# EAGLE design Gimbal Driveboard (EAGLE 8.4.3)
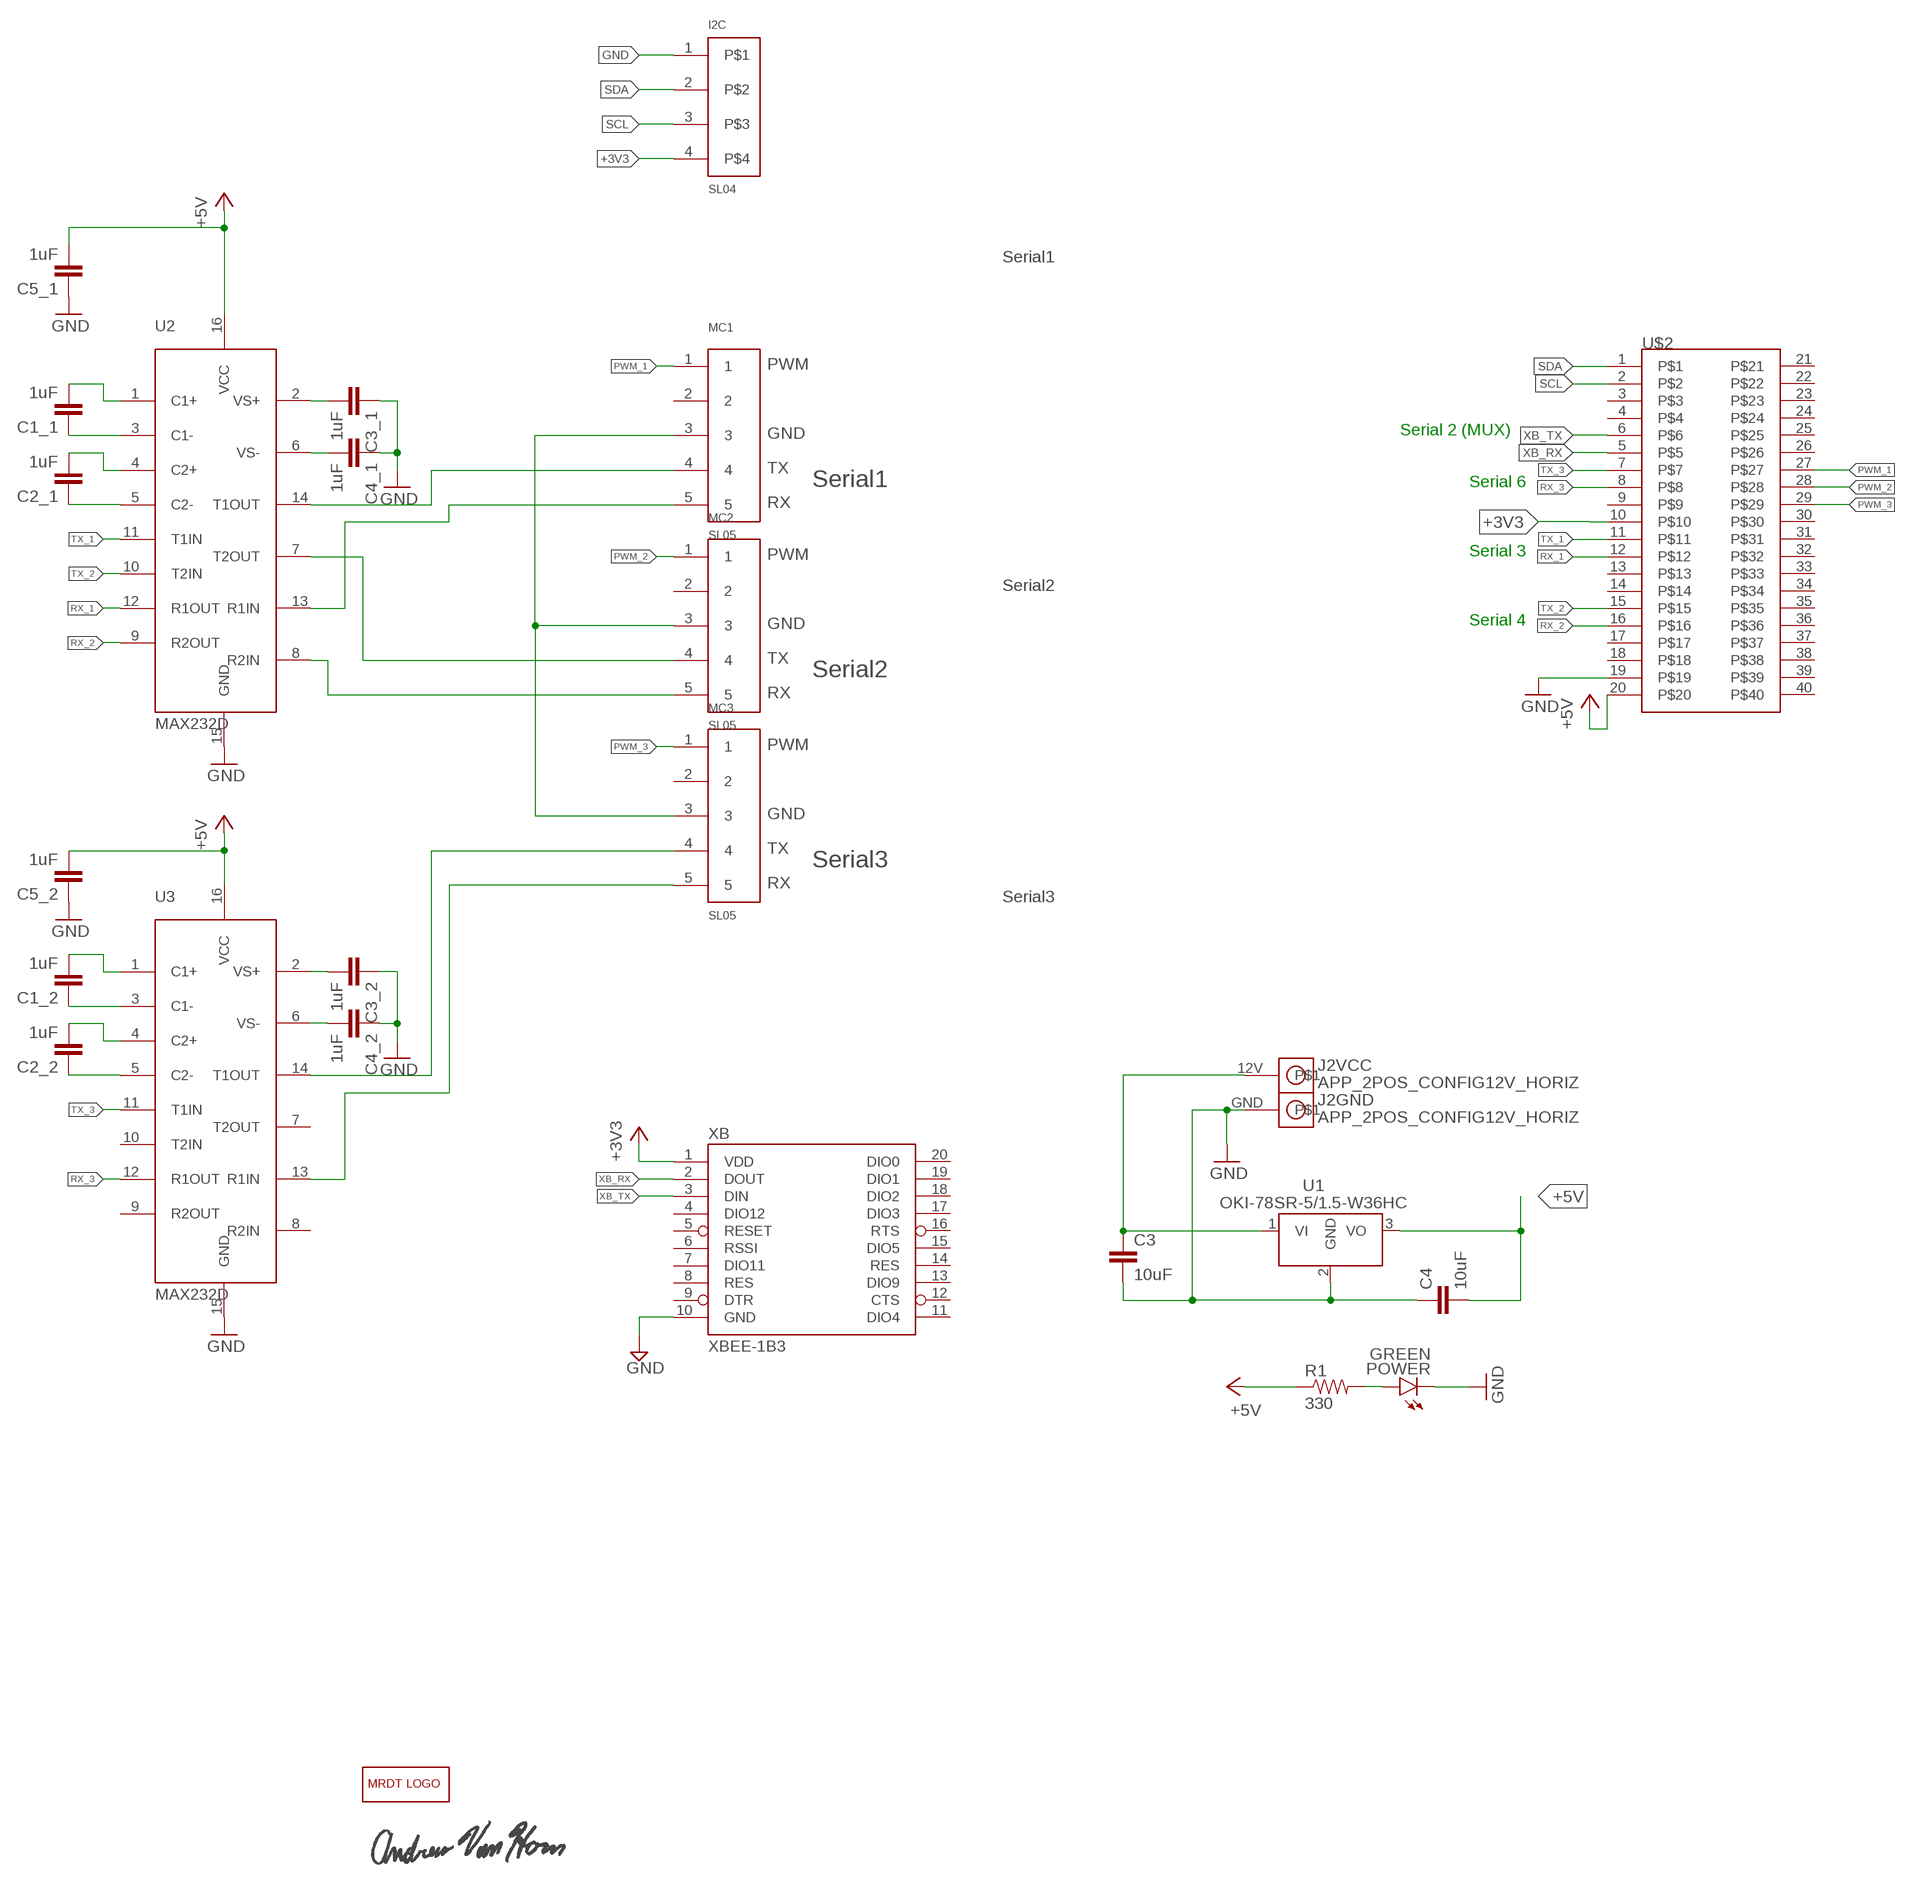
[diagram p0: schematic, sheet 1]

## Parts
C1_1  1uF  CAP0805  [0805]
C1_2  1uF  CAP0805  [0805]
C2_1  1uF  CAP0805  [0805]
C2_2  1uF  CAP0805  [0805]
C3  10uF  CAP0805  [0805]
C3_1  1uF  CAP0805  [0805]
C3_2  1uF  CAP0805  [0805]
C4  10uF  CAP0805  [0805]
C4_1  1uF  CAP0805  [0805]
C4_2  1uF  CAP0805  [0805]
C5_1  1uF  CAP0805  [0805]
C5_2  1uF  CAP0805  [0805]
I2C  SL04  [MOLEX_SL_04_TH]
J2  APP_2POS_CONFIG12V_HORIZ  [APP45_12V_HORIZ_CONFIG]
LOGO1  MRDT_LOGO  [MRDT_LOGO]
MC1  SL05  [MOLEX_SL_05_TH]
MC2  SL05  [MOLEX_SL_05_TH]
MC3  SL05  [MOLEX_SL_05_TH]
POWER  GREEN  LED-GREEN1206  [LED-1206]
R1  330  0.22OHM-1/4W-1%(0805)  [0805]
U1  OKI-78SR-5/1.5-W36HC  [OKI-78SR_HORIZ]
U2  MAX232D  [SOIC16]
U3  MAX232D  [SOIC16]
U$2  TI_BACKPACK_HEADER  [TI_BACKPACK_HEADER]
U$3  ANDREW_VAN_HORN_SIGNATURE  [ANDREW_VAN_HORN_SIGNATURE]
XB  XBEE-1B3  [XBEE-SMD]

## Nets
+3V3: I2C.4 U$2.10 XB.1(VDD)
+5V: C4.2 C5_1.2 C5_2.2 R1.1 U1.3(VO) U2.16(VCC) U3.16(VCC) U$2.20
GND: C3.2 C3_1.1 C3_2.1 C4.1 C4_1.1 C4_2.1 C5_1.1 C5_2.1 I2C.1 J2.GND MC1.3 MC2.3 MC3.3 POWER.C U1.2(GND) U2.15(GND) U3.15(GND) U$2.19 XB.10(GND)
N$3: C1_1.2 U2.1(C1+)
N$4: C1_1.1 U2.3(C1-)
N$5: C3.1 J2.12V U1.1(VI)
N$6: C2_1.2 U2.4(C2+)
N$7: C2_1.1 U2.5(C2-)
N$8: C3_1.2 U2.2(VS+)
N$9: C4_1.2 U2.6(VS-)
N$11: C1_2.2 U3.1(C1+)
N$12: C1_2.1 U3.3(C1-)
N$13: C2_2.2 U3.4(C2+)
N$14: C3_2.2 U3.2(VS+)
N$15: C4_2.2 U3.6(VS-)
N$16: C2_2.1 U3.5(C2-)
N$17: POWER.A R1.2
N$32: MC3.4 U3.14(T1OUT)
N$33: MC3.5 U3.13(R1IN)
N$34: MC2.5 U2.8(R2IN)
N$35: MC2.4 U2.7(T2OUT)
N$36: MC1.4 U2.14(T1OUT)
N$37: MC1.5 U2.13(R1IN)
PWM_1: MC1.1 U$2.27
PWM_2: MC2.1 U$2.28
PWM_3: MC3.1 U$2.29
RX_1: U2.12(R1OUT) U$2.12
RX_2: U2.9(R2OUT) U$2.16
RX_3: U3.12(R1OUT) U$2.8
SCL: I2C.3 U$2.2
SDA: I2C.2 U$2.1
TX_1: U2.11(T1IN) U$2.11
TX_2: U2.10(T2IN) U$2.15
TX_3: U3.11(T1IN) U$2.7
XB_RX: U$2.5 XB.2(DOUT)
XB_TX: U$2.6 XB.3(DIN)
Unconnected: MC1.2 MC2.2 MC3.2 U3.7(T2OUT) U3.8(R2IN) U3.9(R2OUT) U3.10(T2IN) U$2.3 U$2.4 U$2.9 U$2.13 U$2.14 U$2.17 U$2.18 U$2.21 U$2.22 U$2.23 U$2.24 U$2.25 U$2.26 U$2.30 U$2.31 U$2.32 U$2.33 U$2.34 U$2.35 U$2.36 U$2.37 U$2.38 U$2.39 U$2.40 XB.4(DIO12) XB.5(RESET) XB.6(RSSI) XB.7(DIO11) XB.8(RES) XB.9(DTR) XB.11(DIO4) XB.12(CTS) XB.13(DIO9) XB.14(RES) XB.15(DIO5) XB.16(RTS) XB.17(DIO3) XB.18(DIO2) XB.19(DIO1) XB.20(DIO0)

## Notes on the sheet
- Serial1
- PWM
- GND | Serial 2 (MUX)
- TX
- Serial1 | Serial 6
- RX
- PWM | Serial 3
- Serial2
- GND | Serial 4
- TX
- Serial2
- RX
- PWM
- GND
- TX
- Serial3
- RX
- Serial3

## Library data of the parts
C1_1 C1_2 C2_1 C2_2 C3 C3_1 C3_2 C4 C4_1 C4_2 C5_1 C5_2 = SparkFun-Capacitors:CAP: Capacitor Standard 0603 ceramic capacitor, and 0.1" leaded capacitor.
I2C = MRDT-Connectors:SL04
J2 = MRDT-Connectors:APP_2POS_CONFIG; COLOR1: YELLOW; COLOR2: BLACK
LOGO1 = MRDT-Hardware:MRDT_LOGO
MC1-MC3 = MRDT-Connectors:SL05
POWER = SparkFun-LED:LED-GREEN: Various green LEDs Green LEDs used in SFE Production 0603- DIO-00821 LARGE- DIO-00862 LILYPAD- DIO-09910; PROD_ID: DIO-00862
R1 = SparkFun-Resistors:0.22OHM-1/4W-1%(0805): RES-09883; PROD_ID: RES-09883; VALUE: 0.22
U1 = MRDT-ICs:OKI-78SR-*/1.5-W36?C: 4.95W DC/DC Converter Manufacturer: Murata; VOUT: +5v
U2 U3 = MRDT-ICs:MAX*232; OPERATING_VOLTAGE: 5V
U$2 = TI_HEADERS:TI_BACKPACK_HEADER: TI's standard for backpack header spacing with 80 pins
U$3 = MRDT-Signatures:ANDREW_VAN_HORN_SIGNATURE
XB = SparkFun:XBEE-1

## Net classes
0 default: width 0.254 mm, clearance 0.254 mm

## Board
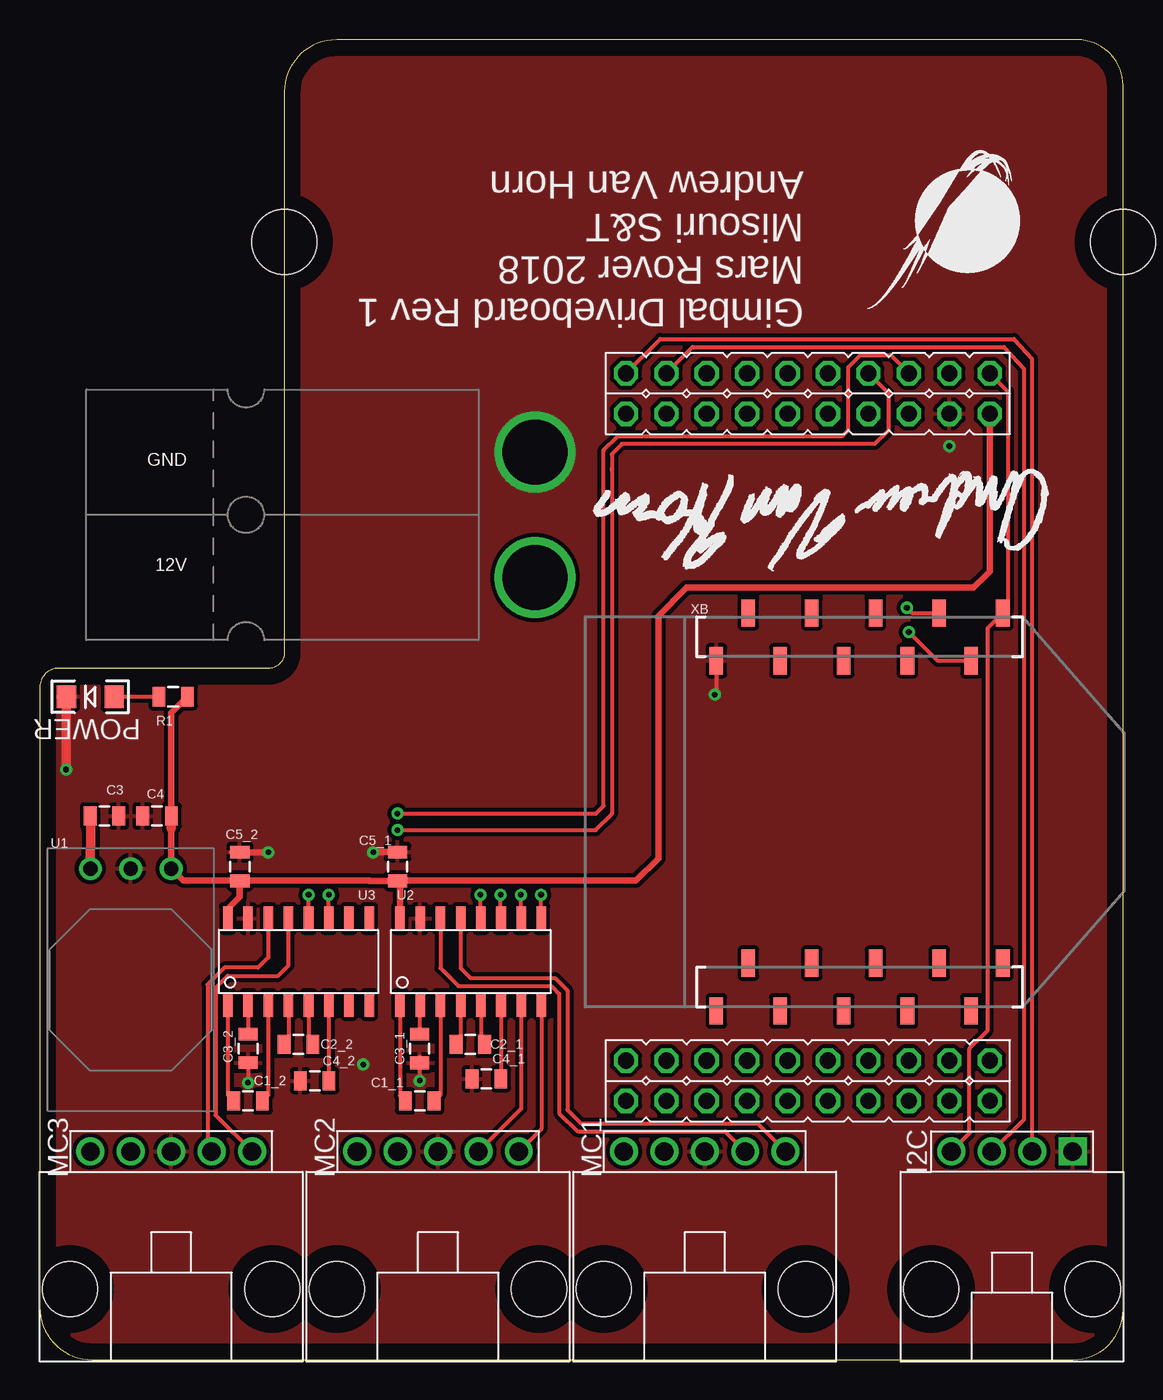
[diagram p1: board, top side]
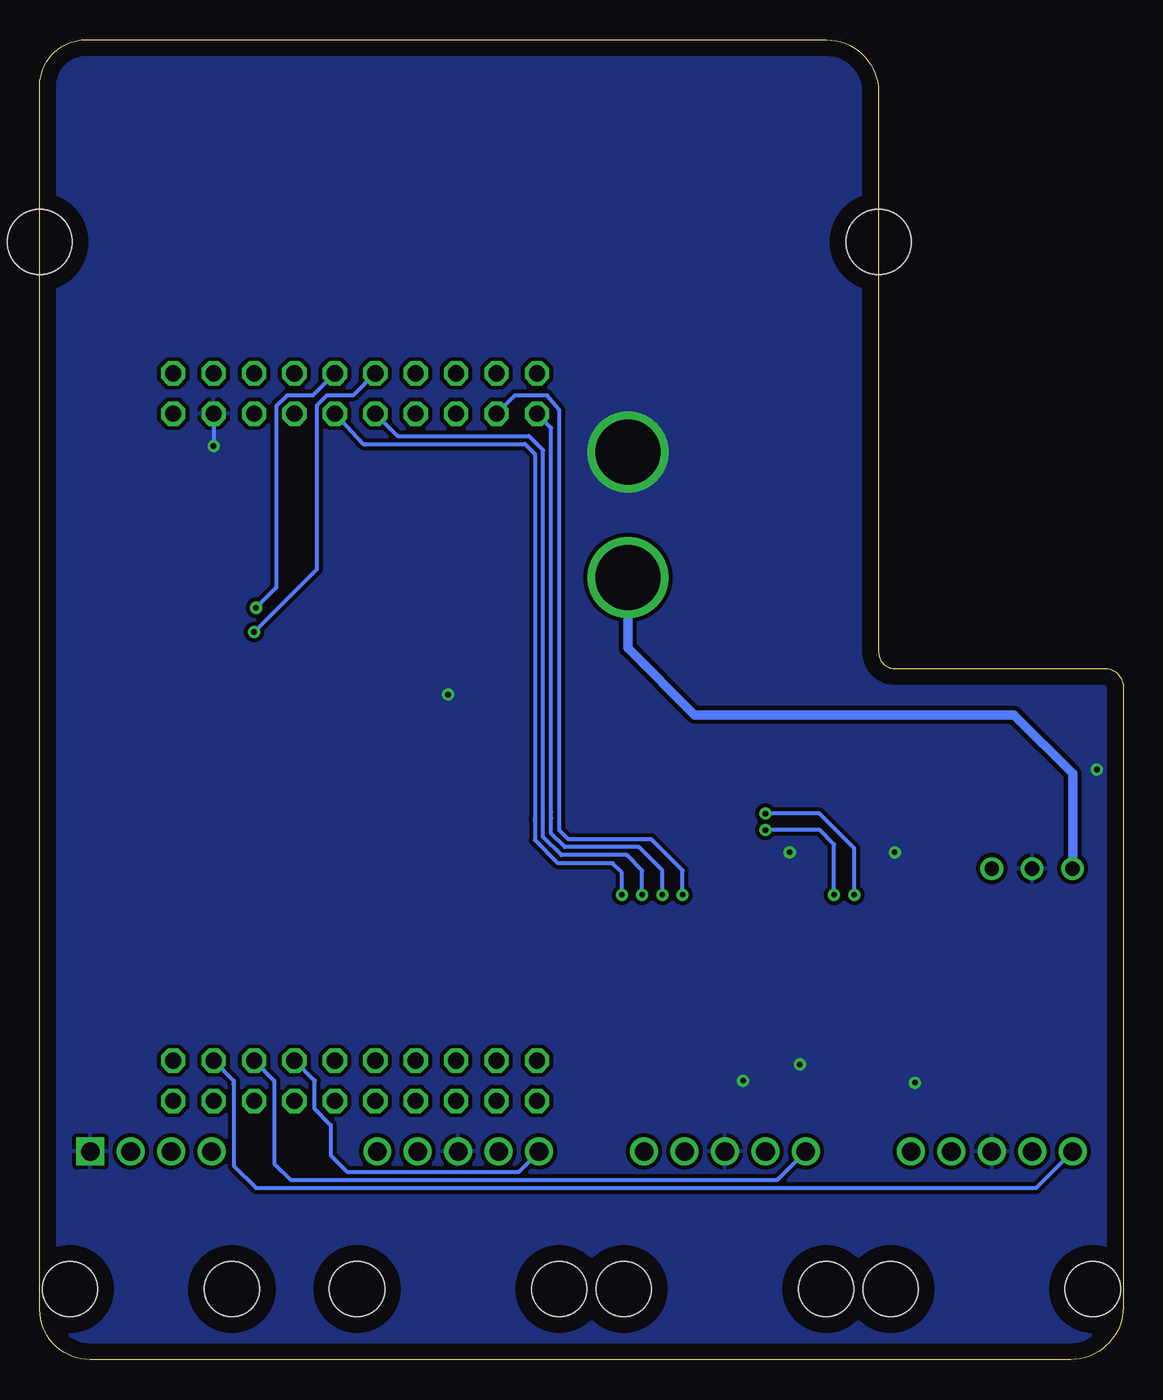
[diagram p2: board, bottom side, seen from below]

Size 68.07 x 82.93 mm. Coordinates in mm from the lower left corner, seen from the top.
Outline: 15.37,79.65 15.37,44.43 arc-90 14.37,43.43 1.16,43.43 arc90 0,42.27 0,3.3 arc90 3.3,0 64.92,0 arc90 68.07,3.15 68.07,80.05 arc90 65.2,82.93 18.64,82.93 arc90 15.37,79.65
Copper layers (1*16): Top 0.035mm / dielectric 1.5mm / Bottom 0.035mm
Design rules "default": minimum track width 6mil, minimum drill 0.35mm, track to track 6mil, track to pad 6mil, pad to pad 6mil, via to via 6mil, smd to smd 6mil, copper to edge 40mil, drill to drill 6mil, minimum pad ring 10mil, minimum via ring 8mil, stop-mask expansion 4mil, vias tented up to drill 0mil, thermal gap 10mil
Holes 4.06 mm at 15.37,70.23 68.07,70.23

### Footprints (pad centres in the part's own frame; a part is rotated, then mirrored left to right if it is on the bottom)
0805 = smd 0.8 x 1.2: 1 -0.9,0; 2 0.9,0
MOLEX_SL_04_TH = drill 1.168 square: 1 -3.81,0 | drill 1.168: 2 -1.27,0; 3 1.27,0; 4 3.81,0 | hole 3.454: -5.08,8.636; 5.08,8.636
APP45_12V_HORIZ_CONFIG = drill 4.064: 12V 28.194,3.937; GND 28.194,11.811
MOLEX_SL_05_TH = drill 1.168: 1 5.08,0; 2 2.54,0; 3 0,0; 4 -2.54,0; 5 -5.08,0 | hole 3.454: -6.35,8.636; 6.35,8.636
LED-1206 = smd 1.2 x 1.4: A -1.5,0; C 1.5,0
OKI-78SR_HORIZ = drill 0.9 pad 1.422: 1 0,0; 2 -2.54,0; 3 -5.08,0
SOIC16 = smd 0.6 x 1.55: 1 -4.445,-2.7; 2 -3.175,-2.7; 3 -1.905,-2.7; 4 -0.635,-2.7; 5 0.635,-2.7; 6 1.905,-2.7; 7 3.175,-2.7; 8 4.445,-2.7; 9 4.445,2.7; 10 3.175,2.7; 11 1.905,2.7; 12 0.635,2.7; 13 -0.635,2.7; 14 -1.905,2.7; 15 -3.175,2.7; 16 -4.445,2.7
TI_BACKPACK_HEADER = drill 1.016 octagon: 1 1.27,46.99; 2 3.81,46.99; 3 6.35,46.99; 4 8.89,46.99; 5 11.43,46.99; 6 13.97,46.99; 7 16.51,46.99; 8 19.05,46.99; 9 21.59,46.99; 10 24.13,46.99; 11 1.27,44.45; 12 3.81,44.45; 13 6.35,44.45; 14 8.89,44.45; 15 11.43,44.45; 16 13.97,44.45; 17 16.51,44.45; 18 19.05,44.45; 19 21.59,44.45; 20 24.13,44.45; 21 1.27,3.81; 22 3.81,3.81; 23 6.35,3.81; 24 8.89,3.81; 25 11.43,3.81; 26 13.97,3.81; 27 16.51,3.81; 28 19.05,3.81; 29 21.59,3.81; 30 24.13,3.81; 31 1.27,1.27; 32 3.81,1.27; 33 6.35,1.27; 34 8.89,1.27; 35 11.43,1.27; 36 13.97,1.27; 37 16.51,1.27; 38 19.05,1.27; 39 21.59,1.27; 40 24.13,1.27
XBEE-SMD = smd 1.7 x 0.85: 1 -12.5,20; 2 -9.5,18; 3 -12.5,16; 4 -9.5,14; 5 -12.5,12; 6 -9.5,10; 7 -12.5,8; 8 -9.5,6; 9 -12.5,4; 10 -9.5,2; 11 12.5,2; 12 9.5,4; 13 12.5,6; 14 9.5,8; 15 12.5,10; 16 9.5,12; 17 12.5,14; 18 9.5,16; 19 12.5,18; 20 9.5,20

### Placement (x,y rotation side)
C1_1  23.88,16.26 180 top
C1_2  13.08,16.26 180 top
C2_1  27.05,19.81 180 top
C2_2  16.26,19.81 180 top
C3  4.06,34.16 0 top
C3_1  23.87,19.56 90 top
C3_2  13.08,19.56 90 top
C4  7.37,34.16 0 top
C4_1  28.07,17.65 0 top
C4_2  17.27,17.53 0 top
C5_1  22.48,30.99 270 top
C5_2  12.57,30.99 270 top
I2C  61.09,13.08 180 top
J2  2.92,45.21 0 top
LOGO1  61.59,76.83 180 top
MC1  41.78,13.08 180 top
MC2  25.02,13.08 180 top
MC3  8.25,13.08 180 top
POWER  3.17,41.66 180 top
R1  8.38,41.66 180 top
U1  3.17,30.86 180 top
U2  27.08,25.02 0 top
U3  16.26,25.02 0 top
U$2  35.56,14.99 0 top
U$3  64.64,56.9 180 top
XB  40.51,34.42 270 top

### Tracks (layer width: path | path; a pad name or v marks a point on that pad's centre or on a via)
+3V3
  Top 0.254: I2C.4 58.42,14.22 58.42,19.56 59.56,20.7 59.56,45.97 XB.1 60.83,47.24 60.83,60.83 U$2.10
+5V
  Top 0.254: 22.61,27.75 U2.16 | 12.07,30.1 C5_2.2 | 22.63,30.07 22.62,30.09 C5_1.2 22.72,30.09
  Top 0.406: 22.61,28.19 22.61,27.75 | 8.25,33.39 U1.3 9.02,30.1 12.07,30.1 20.7,30.1 20.7,30.09 C5_1.2 22.61,30.1 | 22.73,27.82 U2.16 22.63,30.07 22.61,30.1 | 59.44,49.28 59.69,49.53 | 59.44,49.28 58.67,48.51 40.64,48.51 38.86,46.74 38.86,31.5 37.46,30.1 22.61,30.1 | 22.72,30.09 22.73,30.1 | C4.2 8.27,40.64 R1.1 | C5_2.2 12.57,29.08 11.81,28.32 U3.16 | 59.69,49.53 59.44,49.28 | U$2.20 59.69,49.53
  Top 0.61: 8.25,33.39 C4.2 8.27,33.42
GND  (via drill 0.35)
  Top 0.254: 23.88,19.04 C3_1.1 23.87,18.04 v23.88,17.53 | C3_2.1 v13.08,17.4 | XB.10 42.51,41.88 v42.42,41.78
  Top 0.406: C5_1.1 20.97,31.89 v20.96,31.88 | C5_2.1 12.08,31.88 v14.35,31.88
  Top 0.61: POWER.C 1.67,40.23 v1.65,37.08
  Bottom 0.254: U$2.19 v57.15,57.4
  other vias: 20.32,18.54
  pour Top: 0,64.13 2.67,83.69 67.44,83.31 68.2,0.13 -0.76,0
  pour Bottom: -0.38,83.44 67.69,83.69 68.2,0.13 -0.76,0.13
N$3
  Top 0.254: U2.1 22.63,16.6 C1_1.2
N$4
  Top 0.254: U2.3 25.17,16.65 C1_1.1
N$5
  Top 0.61: C3.1 3.19,33.28 U1.1
  Bottom 0.61: U1.1 3.17,36.83 6.86,40.51 26.92,40.51 31.12,44.7 J2.12V
N$6
  Top 0.254: U2.4 26.44,20.1 C2_1.2
N$7
  Top 0.254: U2.5 27.71,20.05 C2_1.1
N$8
  Top 0.254: U2.2 23.87,22.29 C3_1.2
N$9
  Top 0.254: U2.6 28.97,22.3 C4_1.2
N$11
  Top 0.254: U3.1 11.81,16.63 C1_2.2
N$12
  Top 0.254: U3.3 14.35,16.63 C1_2.1
N$13
  Top 0.254: U3.4 15.62,20.08 C2_2.2
N$14
  Top 0.254: U3.2 C3_2.2
N$15
  Top 0.254: U3.6 C4_2.2
N$16
  Top 0.254: U3.5 16.89,20.08 C2_2.1
N$17
  Top 0.254: POWER.A R1.2
N$32
  Top 0.254: U3.14 14.35,25.27 13.72,24.64 11.6,24.64 10.54,23.58 10.54,13.34 MC3.4
N$33
  Top 0.254: U3.13 15.62,24.77 14.99,24.13 11.81,24.13 11.05,23.37 11.05,15.37 MC3.5
N$34
  Top 0.254: U2.8 31.52,14.5 MC2.5
N$35
  Top 0.254: U2.7 30.25,15.77 MC2.4
N$36
  Top 0.254: U2.14 25.17,24.61 26.31,23.48 32.15,23.48 32.64,22.99 32.64,15.49 33.78,14.35 43.05,14.35 MC1.4
N$37
  Top 0.254: U2.13 26.44,24.61 27.07,23.98 32.36,23.98 33.15,23.2 33.15,15.7 33.99,14.86 45.09,14.86 MC1.5
PWM_1
  Bottom 0.254: MC1.1 37.97,11.81 48.77,11.81 49.78,12.83 49.78,14.73 50.8,15.75 50.8,17.53 U$2.27
PWM_2
  Bottom 0.254: MC2.1 21.72,11.3 52.32,11.3 53.34,12.32 53.34,17.53 U$2.28
PWM_3
  Bottom 0.254: 55.88,17.27 55.88,17.4 | 55.88,17.27 55.88,12.19 54.48,10.79 5.46,10.79 MC3.1 | U$2.29 55.88,17.53 55.88,17.27
RX_1  (via drill 0.35)
  Top 0.254: U2.12 27.69,27.75 v27.69,29.21
  Bottom 0.254: v27.69,29.21 27.69,30.73 29.67,32.71 34.87,32.71 35.43,33.27 35.43,59.69 36.2,60.58 38.23,60.58 U$2.12
RX_2  (via drill 0.35)
  Top 0.254: 31.37,28.32 31.37,27.87 U2.9 31.5,27.75 v31.5,29.21
  Bottom 0.254: v31.5,29.21 31.5,30.61 32.08,31.19 35.5,31.19 36.96,32.64 36.96,33.91 | 36.96,33.91 36.96,34.04 | 36.96,33.91 36.96,56.9 37.59,57.53 47.75,57.53 U$2.16
RX_3  (via drill 0.35)
  Top 0.254: U3.12 v16.89,29.21 | v22.48,34.31 34.95,34.31 35.43,34.8 35.43,57.15 36.32,58.04 50.42,58.04 50.8,58.42 50.8,62.36 51.56,63.12 53.47,63.12 U$2.8
  Bottom 0.254: v16.89,29.21 16.89,32.13 19.07,34.31 v22.48,34.31
SCL
  Top 0.254: I2C.3 61.85,15.11 61.85,62.23 60.58,63.63 41.02,63.63 U$2.2
SDA
  Top 0.254: I2C.2 62.36,62.87 61.21,64.13 38.99,64.13 U$2.1
TX_1  (via drill 0.35)
  Top 0.254: U2.11 28.96,27.75 v28.96,29.21
  Bottom 0.254: v28.96,29.21 28.96,30.73 30.43,32.21 35.09,32.21 35.94,33.06 35.94,34.04 | 35.94,34.04 35.94,34.42 | U$2.11 35.94,58.55 35.94,34.04
TX_2  (via drill 0.35)
  Top 0.254: U2.10 30.23,27.75 v30.23,29.21
  Bottom 0.254: v30.23,29.21 30.23,30.73 31.19,31.7 35.29,31.7 36.45,32.85 36.45,57.15 37.34,58.04 45.59,58.04 U$2.15
TX_3  (via drill 0.35)
  Top 0.254: U3.11 v18.16,29.21 | v22.48,33.27 34.92,33.27 35.94,34.29 35.94,55.88 | 35.94,55.88 35.94,56.01 | 35.94,55.88 35.94,56.9 36.58,57.53 52.45,57.53 53.34,58.42 53.34,60.71 U$2.7
  Bottom 0.254: v18.16,29.21 18.16,32.38 19.05,33.27 v22.48,33.27
XB_RX  (via drill 0.35)
  Top 0.254: v54.61,45.72 56.41,43.92 XB.2
  Bottom 0.254: U$2.5 48.39,60.58 50.04,60.58 50.67,59.94 50.67,49.66 v54.61,45.72
XB_TX  (via drill 0.35)
  Top 0.254: v54.48,47.24 54.81,46.92 XB.3
  Bottom 0.254: U$2.6 50.93,60.58 52.54,60.58 53.21,59.91 53.21,48.51 v54.48,47.24

### Text on the board
tNames: Gimbal Driveboard Rev 1 / Mars Rover 2018 / Misouri S&T / Andrew Van Horn